# EAGLE design Raspberry_pi_shild_v1-- (EAGLE 6.5.0)
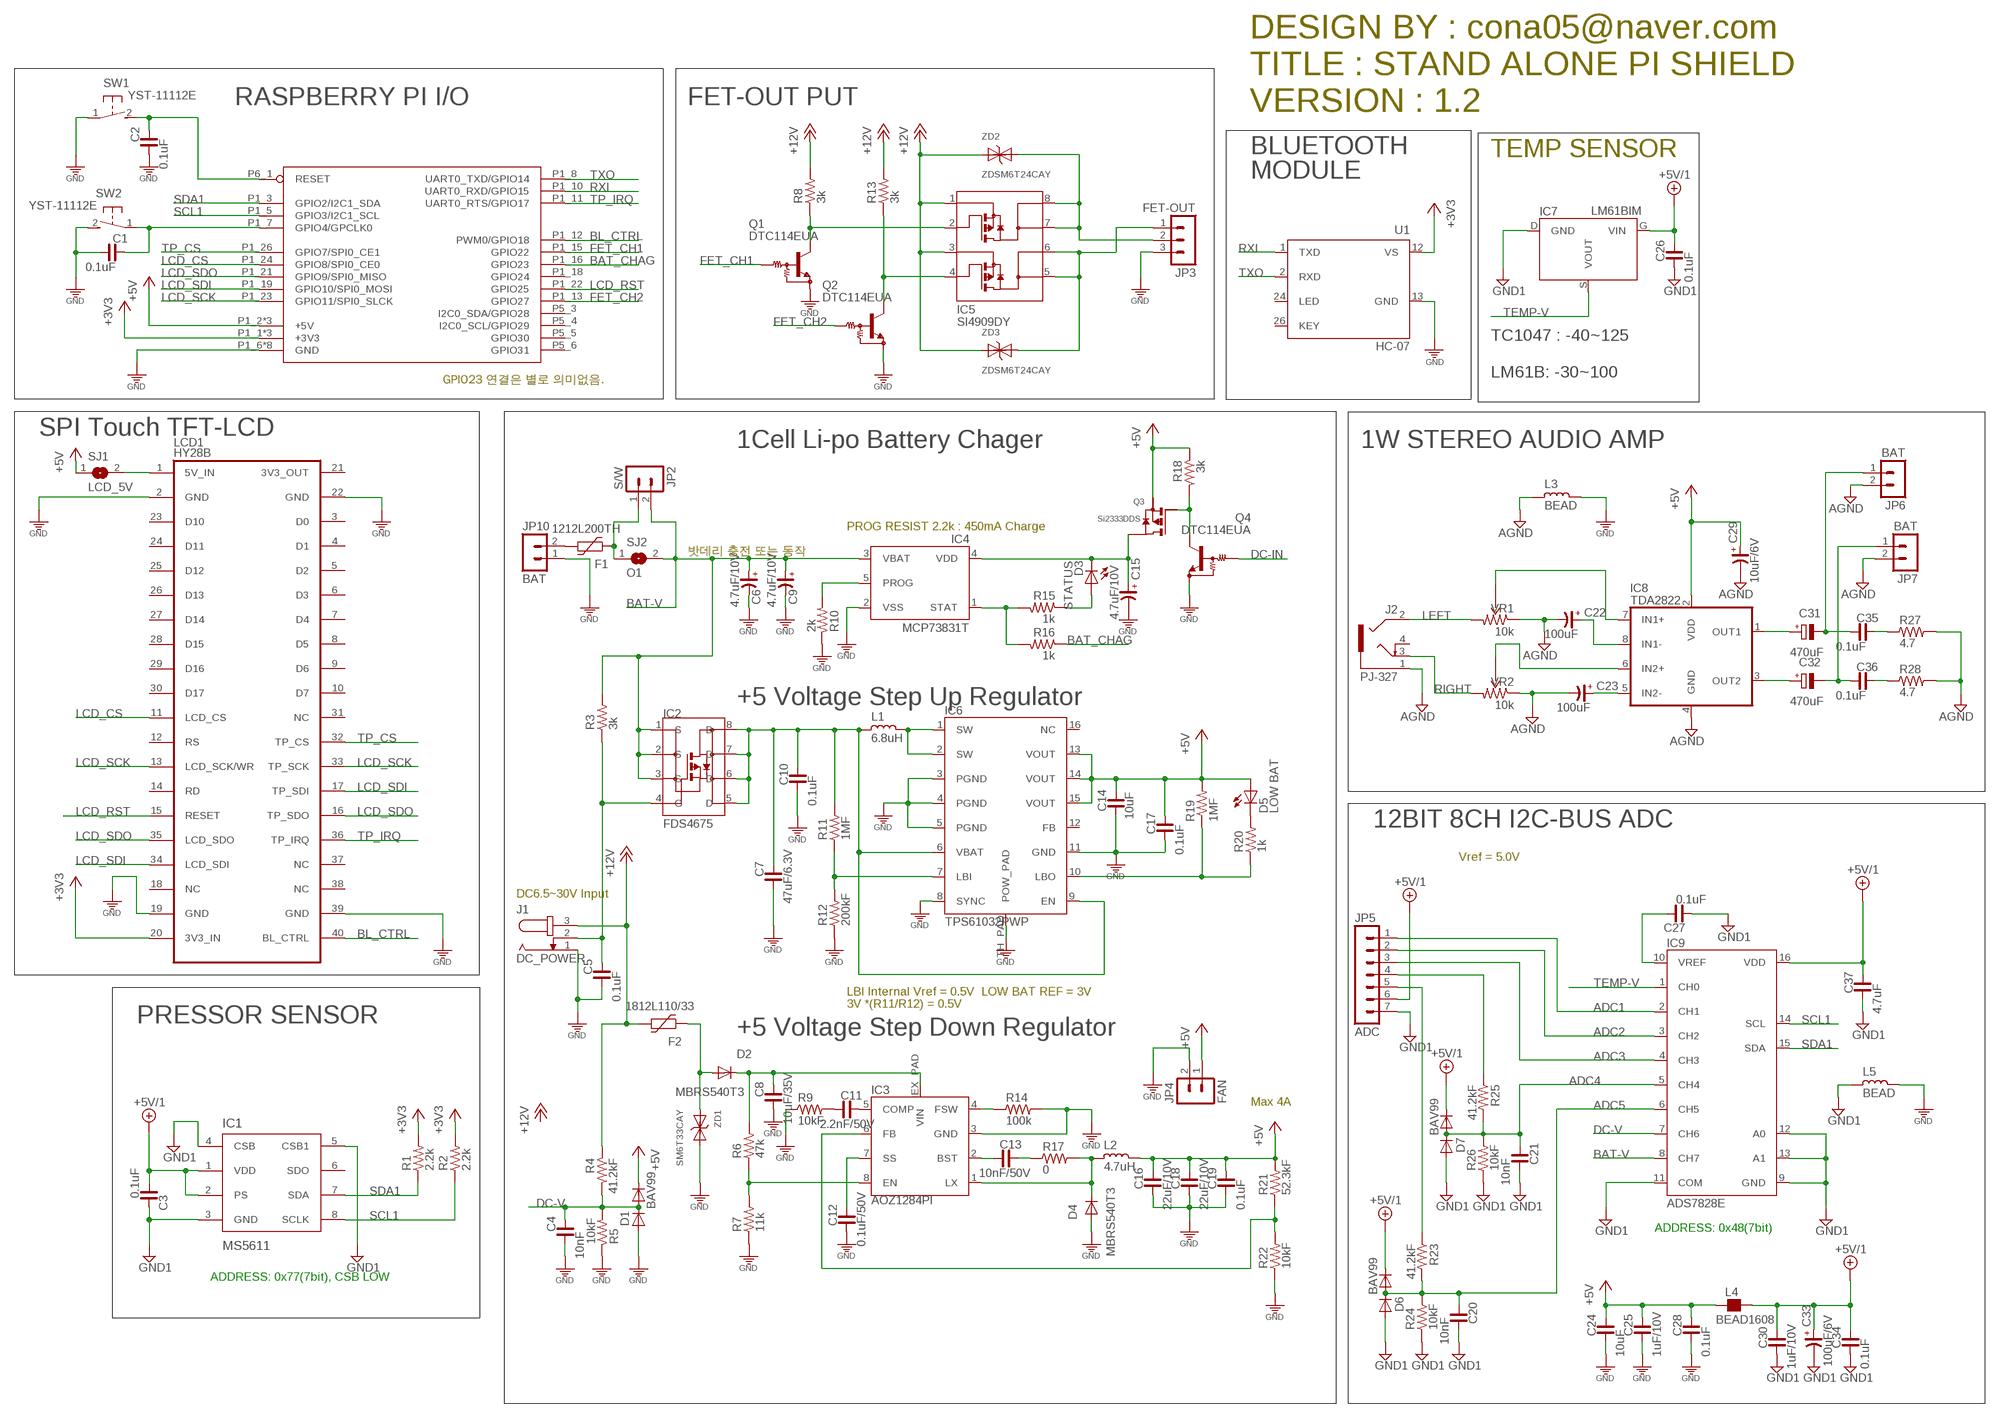
[diagram p0: schematic, sheet 1]

## Parts
C1  0.1uF  C_0603  [C0603]
C2  0.1uF  C_0603  [C0603]
C3  0.1uF  C_0603  [C0603]
C4  10nF  C_0603  [C0603]
C5  0.1uF  C_0603  [C0603]
C6  4.7uF/10V  CP_3216-18  [C3216-18/T]
C7  47uF/6.3V  C_3216  [C3216]
C8  10uF/35V  C_3225  [C3225]
C9  4.7uF/10V  CP_3216-18  [C3216-18/T]
C10  0.1uF  C_0603  [C0603]
C11  2.2nF/50V  C_0603  [C0603]
C12  0.1uF/50V  C_0603  [C0603]
C13  10nF/50V  C_0603  [C0603]
C14  10uF  C_2012  [C2012]
C15  4.7uF/10V  CP_3216-18  [C3216-18/T]
C16  22uF/10V  C_3216  [C3216]
C17  0.1uF  C_0603  [C0603]
C18  22uF/10V  C_3216  [C3216]
C19  0.1uF  C_0603  [C0603]
C20  10nF  C_0603  [C0603]
C21  10nF  C_0603  [C0603]
C22  100uF  CP_3528-21  [C3528-21/T]
C23  100uF  CP_3528-21  [C3528-21/T]
C24  10uF  C_0805  [C0805]
C25  1uF/10V  C_0603  [C0603]
C26  0.1uF  C_0603  [C0603]
C27  0.1uF  C_0603  [C0603]
C28  0.1uF  C_0603  [C0603]
C29  10uF/6V  CP_3216-18  [C3216-18/T]
C30  1uF/10V  C_0603  [C0603]
C31  470uF  CPOL-EUD/7343-31W  [D/7343-31W]
C32  470uF  CPOL-EUD/7343-31W  [D/7343-31W]
C33  100uF/6V  CP_3528-21  [C3528-21/T]
C34  0.1uF  C_0603  [C0603]
C35  0.1uF  C_0603  [C0603]
C36  0.1uF  C_0603  [C0603]
C37  4.7uF  C_0805  [C0805]
D1  BAV99  [SOT23]
D2  MBRS540T3  DIODE-SMC  [SMC]
D3  STATUS  LED3MM  [LED3MM]
D4  MBRS540T3  DIODE-SMC  [SMC]
D5  LOW BAT  LED3MM  [LED3MM]
D6  BAV99  [SOT23]
D7  BAV99  [SOT23]
F1  1212L200TH  1812L  [1812L]
F2  1812L110/33  1812L  [1812L]
IC1  MS5611  [LCP8]
IC2  FDS4675  HEXFET_P  [SO08]
IC3  AOZ1284PI  [S08-EP1]
IC4  MCP73831T  [SOT23-5L@1]
IC5  SI4909DY  P-CH_DUALSO-8  [SO08-1]
IC6  TPS61032PWP  TPS61032  [R-PDSO-G16-TH_PAD]
IC7  LM61BIM  [SOT23]
IC8  TDA2822  [SO08]
IC9  ADS7828E  ADS7828  [R-PDSO-G16]
J1  DC_POWER  JACK-PLUG0  [SPC4077]
J2  PJ-327  AUDIO_JACK2  [PJ-327-2]
JP2  S/W  MA02MOL-R  [MA02-MOL-R]
JP3  FET-OUT  MA03-1DEF  [MA03]
JP4  FAN  MA02MOL-R  [MA02-MOL-R]
JP5  ADC  MA07-1  [MA07-1T]
JP6  BAT  MA02MOL-R  [MA02-MOL-R]
JP7  BAT  MA02MOL-R  [MA02-MOL-R]
JP10  BAT  MA0253047  [53047-02]
L1  6.8uH  L_4545  [L4545]
L2  4.7uH  L_4545  [L4545]
L3  BEAD  L_0603  [L0603]
L4  BEAD1608  FB_0603  [L0603]
L5  BEAD  L_0603  [L0603]
LCD1  HY28B  [HY28A]
Q1  DTC114EUA  [SC59-BEC]
Q2  DTC114EUA  [SC59-BEC]
Q3  Si2333DDS  P-FET  [SOT23]
Q4  DTC114EUA  [SC59-BEC]
R1  2.2k  R_0603  [R0603]
R2  2.2k  R_0603  [R0603]
R3  3k  R_0603  [R0603]
R4  41.2kF  R_0603  [R0603]
R5  10kF  R_0603  [R0603]
R6  47k  R_0603  [R0603]
R7  11k  R_0603  [R0603]
R8  3k  R_0603  [R0603]
R9  10kF  R_0603  [R0603]
R10  2k  R_0603  [R0603]
R11  1MF  R_0603  [R0603]
R12  200kF  R_0603  [R0603]
R13  3k  R_0603  [R0603]
R14  100k  R_0603  [R0603]
R15  1k  R_0603  [R0603]
R16  1k  R_0603  [R0603]
R17  0  R_0603  [R0603]
R18  3k  R_0603  [R0603]
R19  1MF  R-US_R1608  [R0603]
R20  1k  R_0603  [R0603]
R21  52.3kF  R_0603  [R0603]
R22  10kF  R_0603  [R0603]
R23  41.2kF  R_0603  [R0603]
R24  10kF  R_0603  [R0603]
R25  41.2kF  R_0603  [R0603]
R26  10kF  R_0603  [R0603]
R27  4.7  R_0603  [R0603]
R28  4.7  R_0603  [R0603]
SJ1  LCD_5V  SJ  [SJ]
SJ2  O1  SJ  [SJ]
SW1  YST-11112E  [YST-1112E]
SW2  YST-11112E  [YST-1112E]
U1  HC-07  HC-06_MODULEFULL  [HC-06]
U$1  RPI-B-V2NO_SHIELD  [RPI-B-V2]
VR1  10k  R-TRIMMER-SMD3313  [R-TRIMMER-3313J]
VR2  10k  R-TRIMMER-SMD3313  [R-TRIMMER-3313J]
ZD1  SM6T33CAY  ZDSM6T33CAY  [SMB]
ZD2  ZDSM6T24CAY  ZDSM6T33CAY  [SMB]
ZD3  ZDSM6T24CAY  ZDSM6T33CAY  [SMB]

## Nets
+3V3: LCD1.20(3V3_IN) R1.2 R2.2 U1.12(VS) U$1.P1_1(+3V3) U$1.P1_17(+3V3) U$1.P5_2(+3V3)
+5V: C14.1 C16.1 C17.1 C18.1 C19.1 C24.1 C25.1 C28.1 C29.+ D1.S(C) D5.A IC6.13(VOUT) IC6.14(VOUT) IC6.15(VOUT) IC8.2(VDD) JP4.1 L2.1 L4.1 Q3.S(SOURCE) R18.1 R19.2 R21.2 SJ1.1 U$1.P1_2(+5V) U$1.P1_4(+5V) U$1.P5_1(+5V)
+5V/1: C3.2 C26.1 C30.1 C33.+ C34.1 C37.1 D6.S(C) D7.S(C) IC1.1(VDD) IC1.2(PS) IC7.G(VIN) IC9.16(VDD) JP5.6 L4.2
+12V: F2.P$2 IC5.1 IC5.3 J1.3 R4.1 R8.2 R13.2 ZD2.A ZD3.A
ADC1: IC9.2(CH1) JP5.1
ADC2: IC9.3(CH2) JP5.2
ADC3: IC9.4(CH3) JP5.3
ADC4: C21.1 D7.D(AC) IC9.5(CH4) R25.2 R26.2
ADC5: C20.1 D6.D(AC) IC9.6(CH5) R23.2 R24.2
AGND: C22.- C23.- C29.- IC8.4(GND) J2.1 JP6.2 JP7.2 L3.2 R27.2 R28.2 VR1.1 VR2.1
BAT-V: C6.+ C9.+ IC2.1(S) IC2.2(S) IC2.3(S) IC4.3(VBAT) IC9.8(CH7) JP2.2 R3.2 SJ2.2
BAT_CHAG: R16.1 U$1.P1_16(GPIO23)
BL_CTRL: LCD1.40(BL_CTRL) U$1.P1_12(PWM0/GPIO18)
DC-IN: D2.A F2.P$1 Q4.2(IN) ZD1.A
DC-V: C4.1 D1.D(AC) IC9.7(CH6) R4.2 R5.2
FET_CH1: Q1.2(IN) U$1.P1_15(GPIO22)
FET_CH2: Q2.2(IN) U$1.P1_13(GPIO27)
GND [GND]: C1.2 C2.2 C4.2 C5.2 C6.- C7.2 C8.2 C9.- C10.2 C12.2 C14.2 C15.- C16.2 C17.2 C18.2 C19.2 C24.2 C25.2 C28.2 D1.G(A) D4.A IC3.3(GND) IC4.2(VSS) IC6.3(PGND) IC6.4(PGND) IC6.5(PGND) IC6.8(SYNC) IC6.11(GND) IC6.TH_PAD(POW_PAD) J1.1 JP3.3 JP4.2 JP10.1 L3.1 L5.1 LCD1.2(GND) Q1.1(GND) Q2.1(GND) Q4.1(GND) R5.1 R7.1 R9.1 R10.1 R12.1 R14.2 R22.1 SW1.1 SW2.2 U1.13(GND) U$1.P1_6(GND) U$1.P1_9(GND) U$1.P1_14(GND) U$1.P1_20(GND) U$1.P1_25(GND) U$1.P5_7(GND) U$1.P5_8(GND) U$1.P6_2(GND) ZD1.C(K)
GND1: C3.1 C20.2 C21.2 C26.2 C27.2 C30.2 C33.- C34.2 C37.2 D6.G(A) D7.G(A) IC1.3(GND) IC1.4(CSB) IC1.5(CSB1) IC7.D(GND) IC9.9(GND) IC9.11(COM) IC9.12(A0) IC9.13(A1) JP5.7 L5.2 R24.1 R26.1
GND@1 [GND]: LCD1.19(GND) ; supply symbol labelled GND
GND@2 [GND]: LCD1.22(GND) ; supply symbol labelled GND
GND@3 [GND]: LCD1.39(GND) ; supply symbol labelled GND
LCD_CS: LCD1.11(LCD_CS) U$1.P1_24(GPIO8/SPI0_CE0)
LCD_RST: LCD1.15(RESET) U$1.P1_22(GPIO25)
LCD_SCK: LCD1.13(LCD_SCK/WR) LCD1.33(TP_SCK) U$1.P1_23(GPIO11/SPI0_SLCK)
LCD_SDI: LCD1.17(TP_SDI) LCD1.34(LCD_SDI) U$1.P1_19(GPIO10/SPI0_MOSI)
LCD_SDO: LCD1.16(TP_SDO) LCD1.35(LCD_SDO) U$1.P1_21(GPIO9/SPI0_MISO)
LEFT: J2.2 VR1.3
N$1: C1.1 SW2.1 U$1.P1_7(GPIO4/GPCLK0)
N$2: C8.1 D2.C IC3.EX_PAD(VIN) R6.2
N$3: IC3.6(FB) R21.1 R22.2
N$4: C13.2 IC3.2(BST)
N$5: F1.P$1 JP2.1 SJ2.1
N$6: C5.1 IC2.4(G) J1.2 R3.1
N$7: D3.A R15.1
N$8: C13.1 R17.1
N$9: D4.C IC3.1(LX) L2.2 R17.2
N$10: C11.1 IC3.5(COMP)
N$11: C11.2 R9.2
N$12: JP5.5 R23.1
N$13: C2.1 SW1.2 U$1.P6_1(RESET)
N$14: JP5.4 R25.1
N$15: D5.K(C) R20.2
N$16: F1.P$2 JP10.2
N$17: IC6.7(LBI) R11.1 R12.2
N$19: IC3.8(EN) R6.1 R7.2
N$20: IC5.2 Q1.3(OUT) R8.1
N$21: IC3.4(FSW) R14.1
N$22: C27.1 IC9.10(VREF)
N$23: Q3.G(GATE) Q4.3(OUT) R18.2
N$24: C12.1 IC3.7(SS)
N$26: C15.+ D3.K(C) IC4.4(VDD) Q3.D(DRAIN)
N$27: IC4.1(STAT) R15.2 R16.2
N$28: C7.1 C10.1 IC2.5(D) IC2.6(D) IC2.7(D) IC2.8(D) IC6.6(VBAT) IC6.9(EN) L1.2 R11.2
N$29: IC6.10(LBO) R19.1 R20.1
N$30: IC6.1(SW) IC6.2(SW) L1.1
N$31: IC5.4 Q2.3(OUT) R13.1
N$32: LCD1.1(5V_IN) SJ1.2
N$35: IC4.5(PROG) R10.2
N$36: C22.+ IC8.8(IN1-)
N$37: C23.+ IC8.5(IN2-)
N$39: IC8.6(IN2+) VR2.2
N$41: IC8.7(IN1+) VR1.2
N$42: C31.+ IC8.1(OUT1)
N$43: C32.+ IC8.3(OUT2)
N$44: C31.- C35.2 JP6.1
N$45: C32.- C36.2 JP7.1
N$46: C35.1 R27.1
N$47: C36.1 R28.1
RELAY1: IC5.5 IC5.6 JP3.1 ZD3.C(K)
RELAY2: IC5.7 IC5.8 JP3.2 ZD2.C(K)
RIGHT: J2.3 VR2.3
RXI: U1.1(TXD) U$1.P1_10(UART0_RXD/GPIO15)
SCL1: IC1.8(SCLK) IC9.14(SCL) R2.1 U$1.P1_5(GPIO3/I2C1_SCL)
SDA1: IC1.7(SDA) IC9.15(SDA) R1.1 U$1.P1_3(GPIO2/I2C1_SDA)
TEMP-V: IC7.S(VOUT) IC9.1(CH0)
TP_CS: LCD1.32(TP_CS) U$1.P1_26(GPIO7/SPI0_CE1)
TP_IRQ: LCD1.36(TP_IRQ) U$1.P1_11(UART0_RTS/GPIO17)
TXO: U1.2(RXD) U$1.P1_8(UART0_TXD/GPIO14)
Unconnected: IC1.6(SDO) IC6.12(FB) IC6.16(NC) J2.4 LCD1.3(D0) LCD1.4(D1) LCD1.5(D2) LCD1.6(D3) LCD1.7(D4) LCD1.8(D5) LCD1.9(D6) LCD1.10(D7) LCD1.12(RS) LCD1.14(RD) LCD1.18(NC) LCD1.21(3V3_OUT) LCD1.23(D10) LCD1.24(D11) LCD1.25(D12) LCD1.26(D13) LCD1.27(D14) LCD1.28(D15) LCD1.29(D16) LCD1.30(D17) LCD1.31(NC) LCD1.37(NC) LCD1.38(NC) U1.24(LED) U1.26(KEY) U$1.P1_18(GPIO24)

## Notes on the sheet
- DESIGN BY : cona05@naver.com
- TITLE : STAND ALONE PI SHIELD
- RASPBERRY PI I/O | FET-OUT PUT | VERSION : 1.2
- BLUETOOTH | TEMP SENSOR
- MODULE
- TC1047 : -40~125℃
- GPIO23 연결은 별로 의미없음. | LM61B: -30~100℃
- SPI Touch TFT-LCD
- 1Cell Li-po Battery Chager | 1W STEREO AUDIO AMP
- PROG RESIST 2.2k : 450mA Charge
- 밧데리 충전 또는 동작
- +5 Voltage Step Up Regulator
- 12BIT 8CH I2C-BUS ADC
- Vref = 5.0V
- DC6.5~30V Input
- LBI Internal Vref = 0.5V | LOW BAT REF = 3V
- 3V *(R11/R12) = 0.5V
- PRESSOR SENSOR
- +5 Voltage Step Down Regulator
- Max 4A
- ADDRESS: 0x48(7bit)
- ADDRESS: 0x77(7bit), CSB LOW

## Power pins joined to a net without a drawn wire
GPIO30: U$1.P5_5(GPIO30)
GPIO31: U$1.P5_6(GPIO31)
I2C0_SCL/GPIO29: U$1.P5_4(I2C0_SCL/GPIO29)
I2C0_SDA/GPIO28: U$1.P5_3(I2C0_SDA/GPIO28)

## Library data of the parts
C1-C5 C7 C8 C10-C14 C16-C21 C24-C28 C30 C34-C37 = cona_lib:C_: NON-POLARIZED CAP
C6 C9 C15 C22 C23 C29 C33 = rc-master-smd:CP_: POLARIZED CAP
C31 C32 = cona_lib:CPOL-EU: POLARIZED CAPACITOR, European symbol
D1 D6 D7 = cona_lib:BAV99
D2 D4 = diode:DIODE-: DIODE
D3 D5 = cona_lib:LED: LED OSRAM: - CHIPLED LG R971, LG N971, LY N971, LG Q971, LY Q971, LO R971, LY R971 LH N974, LH R974 LS Q976, LO Q976, LY Q976 LO Q996 - Hyper CHIPLED LW Q18S LB Q993, LB Q99A, LB R99A - SideLED LS A670, LO A670, LY A670, LG A670, LP A670 LB A673, LV A673, LT A673, LW A673 LH A674 LY A675 LS A676, LA A676, LO A676, LY A676, LW A676 LS A679, LY A679, LG A679 - Hyper Micro SIDELED® LS Y876, LA Y876, LO Y876, LY Y876 LT Y87S - SmartLED LW L88C, LW L88S LB L89C, LB L89S, LG L890 LS L89K, LO L89K, LY L89K LS L896, LA L896, LO L896, LY L896 - TOPLED LS T670, LO T670, LY T670, LG T670, LP T670 LSG T670, LSP T670, LSY T670, LOP T670, LYG T670 LG T671, LOG T671, LSG T671 LB T673, LV T673, LT T673, LW T673 LH T674 LS T676, LA T676, LO T676, LY T676, LB T676, LH T676, LSB T676, LW T676 LB T67C, LV T67C, LT T67C, LS T67K, LO T67K, LY T67K, LW E67C LS E67B, LA E67B, LO E67B, LY E67B, LB E67C, LV E67C, LT E67C LW T67C LS T679, LY T679, LG T679 LS T770, LO T770, LY T770, LG T770, LP T770 LB T773, LV T773, LT T773, LW T773 LH T774 LS E675, LA E675, LY E675, LS T675 LS T776, LA T776, LO T776, LY T776, LB T776 LHGB T686 LT T68C, LB T68C - Hyper Mini TOPLED® LB M676 - Mini TOPLED Santana® LG M470 LS M47K, LO M47K, LY M47K Source: http://www.osram.convergy.de LUXEON: - LUMILED® LXK2-PW12-R00, LXK2-PW12-S00, LXK2-PW14-U00, LXK2-PW14-V00 LXK2-PM12-R00, LXK2-PM12-S00, LXK2-PM14-U00 LXK2-PE12-Q00, LXK2-PE12-R00, LXK2-PE12-S00, LXK2-PE14-T00, LXK2-PE14-U00 LXK2-PB12-K00, LXK2-PB12-L00, LXK2-PB12-M00, LXK2-PB14-N00, LXK2-PB14-P00, LXK2-PB14-Q00 LXK2-PR12-L00, LXK2-PR12-M00, LXK2-PR14-Q00, LXK2-PR14-R00 LXK2-PD12-Q00, LXK2-PD12-R00, LXK2-PD12-S00 LXK2-PH12-R00, LXK2-PH12-S00 LXK2-PL12-P00, LXK2-PL12-Q00, LXK2-PL12-R00 Source: www.luxeon.com KINGBRIGHT: KA-3528ASYC Source: www.kingbright.com
F1 F2 = ptc-littlefuse:1812L
IC1 = MEASUREMENT_SENSOR:MS5611
IC2 = cona_lib:HEXFET_P
IC3 = cona_lib:AOZ1284PI
IC4 = cona_lib:MCP73831T
IC5 = cona_lib:P-CH_DUAL
IC6 = cona_lib:TPS61032
IC7 = cona_lib:LM61
IC8 = cona_lib:TDA2822
IC9 = cona_lib:ADS7828
J1 = con-jack:JACK-PLUG: DC POWER JACK Power Jack, DC, Right Angle, Through Hole, Rated 5A at 16VDC, PC Terminals Distributor: Farnell (www.Farnell.de) Drawing: 84N1161.pdf / 84N1162.pdf Manufacturer: SPC Technology (www.spctechnology.com) Type: SPC4077 / SPC 4078
J2 = cona_lib:AUDIO_JACK2
JP2 JP4 JP6 JP7 JP10 = cona_lib:MA02
JP3 = cona_lib:MA03-1: PIN HEADER
JP5 = cona_lib:MA07-1
L1-L3 L5 = cona_lib:L_: INDUCTOR
L4 = rc-master-smd:FB_: FERRITE BEAD
LCD1 = TFT-LCD:HY28B
Q1 Q2 Q4 = cona_lib:DTC114EUA: NPN Bias Resistor Transistor
Q3 = cona_lib:P-FET
R1-R18 R20-R28 = cona_lib:R_: RESISTOR
R19 = cona_lib:R-US_: RESISTOR, American symbol
SJ1 SJ2 = cona_lib:SJ: SMD solder JUMPER
SW1 SW2 = switch-tact:YST-11112E
U1 = cona_lib:HC-06_MODULE
U$1 = raspberrypi:RPI-B-V2: Second revision of the Model 2 board including the P5 and P6 headers. Mounting holes have been added. Choose the "SHIELD" variant for a predefined Dimension layer and drilling holes. Theres also a "SHIELD" variant for the Model A without a RJ45 connector.
VR1 VR2 = cona_lib:R-TRIMMER-SMD: SMD R-TRIMMER
ZD1-ZD3 = GRU-EURO6:ZD

## Net classes
0 default: width 0.178 mm, drill 0.3 mm, clearance 0.178 mm
1 power: width 0.152 mm
2 GND: width 0.152 mm, clearance 0.152 mm

## Board
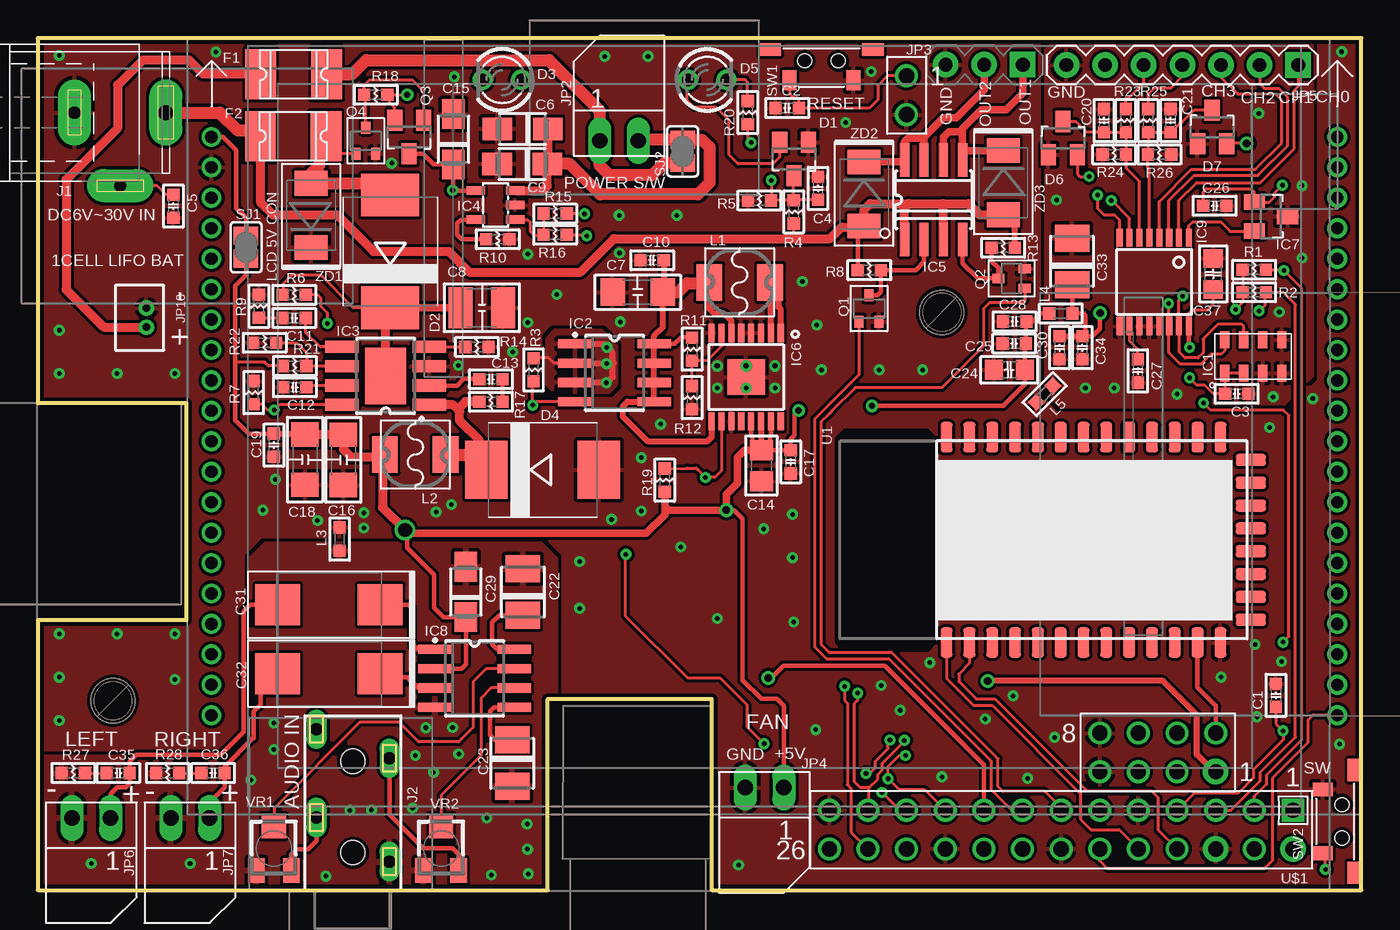
[diagram p1: board, top side]
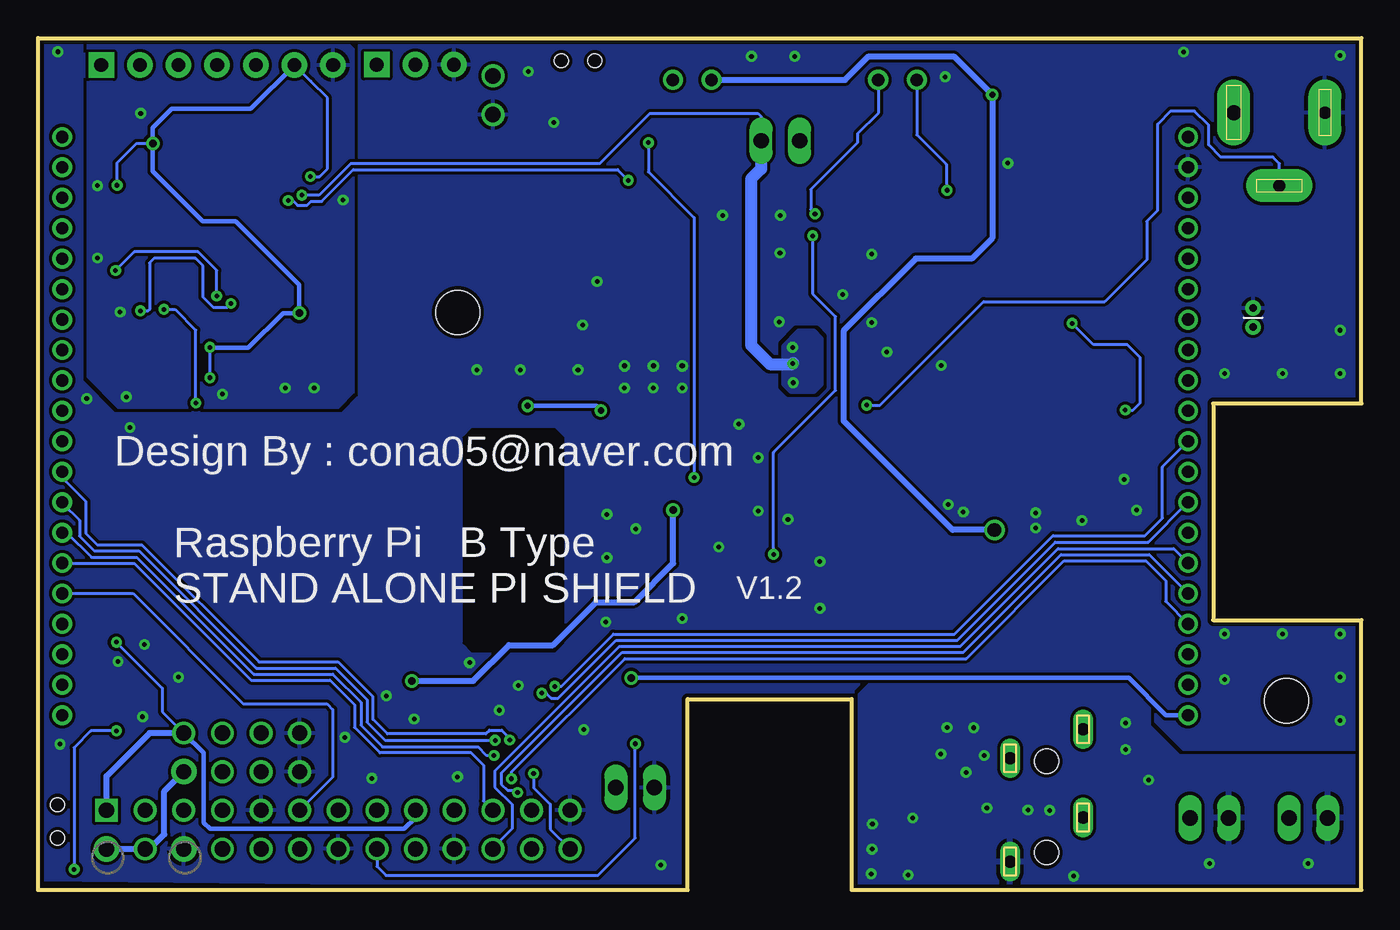
[diagram p2: board, bottom side, seen from below]

Size 87 x 56 mm. Coordinates in mm from the lower left corner, seen from the top.
Outline: 87,56 0,56 0,32 9.75,32 9.75,17.75 0,17.75 0,0 33.5,0 33.5,12.55 44.3,12.55 44.3,0 87,0 87,56
Copper layers (1*16): Top 0.035mm / dielectric 1.5mm / Bottom 0.035mm
Design rules "KHC_mm": minimum track width 0.2mm, minimum drill 0.3mm, track to track 0.2mm, track to pad 0.2mm, pad to pad 0.2mm, via to via 0.2mm, smd to smd 0.2mm, copper to edge 10mil, drill to drill 0.2mm, minimum pad ring 10mil, minimum via ring 8mil, stop-mask expansion 4mil, vias tented up to drill 0mil, thermal gap 10mil
Holes 2.9 mm at 59.4,37.98 4.92,12.45

### Footprints (pad centres in the part's own frame; a part is rotated, then mirrored left to right if it is on the bottom)
C0603 = smd 0.8 x 0.8: 1 -0.762,0; 2 0.762,0
C3216-18/T = smd 1.95 x 1.5: + 1.651,0; - -1.651,0
C3216 = smd 1.6 x 1.8: 1 -1.651,0; 2 1.651,0
C3225 = smd 1.6 x 2.7: 1 -1.397,0; 2 1.397,0
C2012 = smd 1.3 x 1.5: 1 -1.016,0; 2 1.016,0
C3528-21/T = smd 1.778 x 2.286: + 1.524,0; - -1.524,0
C0805 = smd 1.2 x 1.3: 1 -1.016,0; 2 1.016,0
D/7343-31W = smd 2.95 x 2.7: + 3.375,0; - -3.375,0
SOT23 = smd 1 x 1.4: D 0,-1.1; G 0.95,1.1; S -0.95,1.1
SMC = smd 2.8 x 3.8: A 3.7,0; C -3.7,0
LED3MM = drill 0.813: A -1.27,0; K 1.27,0
1812L = smd 2.03 x 3.3: P$1 -2.16,0; P$2 2.16,0
LCP8 = smd 1.1 x 0.6: 1 -1.1,1.875; 2 -1.1,0.625; 3 -1.1,-0.625; 4 -1.1,-1.875; 5 1.1,-1.875; 6 1.1,-0.625; 7 1.1,0.625; 8 1.1,1.875
SO08 = smd 0.6 x 2.2: 1 -1.905,-2.6; 2 -0.635,-2.6; 3 0.635,-2.6; 4 1.905,-2.6; 5 1.905,2.6; 6 0.635,2.6; 7 -0.635,2.6; 8 -1.905,2.6
S08-EP1 = smd 0.8 x 2.2: 1 -1.905,-2.87; 2 -0.635,-2.87; 3 0.635,-2.87; 4 1.905,-2.87; 5 1.905,2.87; 6 0.635,2.87; 7 -0.635,2.87; 8 -1.905,2.87 | smd 3.7 x 2.71: EX_PAD 0,0
SOT23-5L@1 = smd 0.55 x 1.2: 1 -0.95,-1.3; 2 0,-1.3; 3 0.95,-1.3; 4 0.95,1.3; 5 -0.95,1.3
SO08-1 = smd 0.6 x 2.2: 1 -1.905,-2.6; 2 -0.635,-2.6; 3 0.635,-2.6; 4 1.905,-2.6; 5 1.905,2.6; 6 0.635,2.6; 7 -0.635,2.6; 8 -1.905,2.6
R-PDSO-G16-TH_PAD = smd 0.4 x 1.2: 1 -2.275,-2.9; 2 -1.625,-2.9; 3 -0.975,-2.9; 4 -0.325,-2.9; 5 0.325,-2.9; 6 0.975,-2.9; 7 1.625,-2.9; 8 2.275,-2.9; 9 2.275,2.9; 10 1.625,2.9; 11 0.975,2.9; 12 0.325,2.9; 13 -0.325,2.9; 14 -0.975,2.9; 15 -1.625,2.9; 16 -2.275,2.9 | smd 2.46 x 2.31: TH_PAD 0,0
R-PDSO-G16 = smd 0.4 x 1.2: 1 -2.275,-2.9; 2 -1.625,-2.9; 3 -0.975,-2.9; 4 -0.325,-2.9; 5 0.325,-2.9; 6 0.975,-2.9; 7 1.625,-2.9; 8 2.275,-2.9; 9 2.275,2.9; 10 1.625,2.9; 11 0.975,2.9; 12 0.325,2.9; 13 -0.325,2.9; 14 -0.975,2.9; 15 -1.625,2.9; 16 -2.275,2.9
SPC4077 = drill 0.8 pad 2.184 long: 1 -3,0; 2 0,-4.8 | drill 1 pad 2.184 long: 3 3,0
PJ-327-2 = drill 0.8 long: 1 -2.4,-1.9; 2 2.4,-4.8; 3 -2.4,-8.7; 4 2.4,-10.6 | hole 1.6: 0,-2.5; 0,-8.5
MA02-MOL-R = drill 1.016 long: 1 -1.27,0; 2 1.27,0
MA03 = drill 0.9 pad 1.676 square: 1 -2.54,0 | drill 0.9 pad 1.676: 2 0,0; 3 2.54,0
MA07-1T = drill 0.9 pad 1.676 square: 1 -7.62,0 | drill 0.9 pad 1.676: 2 -5.08,0; 3 -2.54,0; 4 0,0; 5 2.54,0; 6 5.08,0; 7 7.62,0
53047-02 = drill 0.5 pad 0.95: 1 -0.625,0; 2 0.625,0
L4545 = smd 1.7 x 2.4: 1 -2,0; 2 2,0
L0603 = smd 0.8 x 0.8: 1 -0.762,0; 2 0.762,0
HY28A = drill 0.8: 1 -37,19; 2 -37,17; 3 -37,15; 4 -37,13; 5 -37,11; 6 -37,9; 7 -37,7; 8 -37,5; 9 -37,3; 10 -37,1; 11 -37,-1; 12 -37,-3; 13 -37,-5; 14 -37,-7; 15 -37,-9; 16 -37,-11; 17 -37,-13; 18 -37,-15; 19 -37,-17; 20 -37,-19; 21 37,19; 22 37,17; 23 37,15; 24 37,13; 25 37,11; 26 37,9; 27 37,7; 28 37,5; 29 37,3; 30 37,1; 31 37,-1; 32 37,-3; 33 37,-5; 34 37,-7; 35 37,-9; 36 37,-11; 37 37,-13; 38 37,-15; 39 37,-17; 40 37,-19
SC59-BEC = smd 0.6 x 0.8: 1 0.65,-0.863; 2 -0.65,-0.863; 3 0,0.863
R0603 = smd 0.8 x 0.8: 1 -0.762,0; 2 0.762,0
SJ = smd 1.168 x 1.6: 1 -0.762,0; 2 0.762,0
YST-1112E = smd 0.9 x 1.3: 1 -2.1,1.025; 2 2.1,1.025 | smd 1.45 x 0.8: SH -3.375,-1; SH@1 3.375,-1 | hole 0.9: 1.1,-0.25; -1.1,-0.25
HC-06 = smd 2 x 0.8: 1 -6.75,9; 2 -6.75,7.5; 3 -6.75,6; 4 -6.75,4.5; 5 -6.75,3; 6 -6.75,1.5; 7 -6.75,0; 8 -6.75,-1.5; 9 -6.75,-3; 10 -6.75,-4.5; 11 -6.75,-6; 12 -6.75,-7.5; 13 -6.75,-9; 22 6.75,-9; 23 6.75,-7.5; 24 6.75,-6; 25 6.75,-4.5; 26 6.75,-3; 27 6.75,-1.5; 28 6.75,0; 29 6.75,1.5; 30 6.75,3; 31 6.75,4.5; 32 6.75,6; 33 6.75,7.5; 34 6.75,9 | smd 0.8 x 2: 14 -5.25,-11; 15 -3.75,-11; 16 -2.25,-11; 17 -0.75,-11; 18 0.75,-11; 19 2.25,-11; 20 3.75,-11; 21 5.25,-11
RPI-B-V2 = drill 1 square: P1_1 0,0 | drill 1 pad 1.676: P1_2 0,2.54; P1_6 5.08,2.54; P5_1 5.08,-2.54 | drill 1: P1_3 2.54,0; P1_4 2.54,2.54; P1_5 5.08,0; P1_7 7.62,0; P1_8 7.62,2.54; P1_9 10.16,0; P1_10 10.16,2.54; P1_11 12.7,0; P1_12 12.7,2.54; P1_13 15.24,0; P1_14 15.24,2.54; P1_15 17.78,0; P1_16 17.78,2.54; P1_17 20.32,0; P1_18 20.32,2.54; P1_19 22.86,0; P1_20 22.86,2.54; P1_21 25.4,0; P1_22 25.4,2.54; P1_23 27.94,0; P1_24 27.94,2.54; P1_25 30.48,0; P1_26 30.48,2.54; P5_2 5.08,-5.08; P5_3 7.62,-2.54; P5_4 7.62,-5.08; P5_5 10.16,-2.54; P5_6 10.16,-5.08; P5_7 12.7,-2.54; P5_8 12.7,-5.08; P6_1 25.4,-48.26; P6_2 25.4,-45.72
R-TRIMMER-3313J = smd 1.1 x 1.6: 1 -1.15,-1.45; 3 1.15,-1.45 | smd 1.6 x 1.6: 2 0,1.45
SMB = smd 1.62 x 2.18: A 2.11,0; C -2.11,0

### Placement (x,y rotation side)
C1  81.38,12.8 90 top
C2  49.25,51.4 180 top
C3  78.8,32.62 180 top
C4  51.27,46.12 90 top
C5  8.9,44.95 270 top
C6  31.85,50.02 0 top
C7  39.42,39.3 180 top
C8  29.18,38.27 0 top
C9  31.82,47.73 0 top
C10  40.38,41.4 180 top
C11  16.85,37.6 180 top
C12  16.88,33.05 180 top
C13  29.77,33.58 180 top
C14  47.55,27.9 270 top
C15  27.3,49.35 270 top
C16  20.07,28.27 270 top
C17  49.48,28.15 270 top
C18  17.55,28.3 270 top
C19  15.5,29.25 270 top
C20  70.08,50.58 90 top
C21  74.45,50.58 90 top
C22  31.88,19.6 270 top
C23  31.18,8.35 90 top
C24  63.85,34.2 180 top
C25  64.17,35.92 180 top
C26  77.35,44.98 0 top
C27  72.3,34.12 270 top
C28  64.2,37.38 180 top
C29  28.12,19.6 270 top
C30  67.15,35.65 270 top
C31  19.12,18.75 0 top
C32  19.12,14.23 0 top
C33  67.97,41.33 270 top
C34  68.65,35.65 270 top
C35  5.27,7.7 0 top
C36  11.5,7.7 0 top
C37  77.25,40.5 90 top
D1  49.7,48.05 0 top
D2  23.15,41.98 90 top
D3  30.5,53.25 180 top
D4  33.17,27.62 0 top
D5  44,53.25 0 top
D6  67.38,49.42 180 top
D7  77.17,50.15 180 top
F1  16.8,53.62 180 top
F2  16.77,49.55 180 top
IC1  79.88,35.08 90 top
IC2  37.9,34 270 top
IC3  22.85,33.8 90 top
IC4  30.07,45.02 90 top
IC5  58.88,45.38 0 top
IC6  46.55,33.73 180 top
IC7  81.05,44.27 90 top
IC8  28.7,13.92 270 top
IC9  73.38,39.98 180 top
J1  5.4,51.1 0 top
J2  20.7,-0.02 180 top
JP2  38.2,49.25 0 top
JP3  62.2,54.25 180 top
JP4  47.75,6.75 180 top
JP5  75.22,54.23 180 top
JP6  3.5,4.75 180 top
JP7  10,4.75 180 top
JP10  7.12,37.62 270 top
L1  46.12,39.95 180 top
L2  24.8,28.62 0 top
L3  19.82,23.08 270 top
L4  67.22,37.9 0 top
L5  66.17,32.6 45 top
LCD1  48.4,30.5 0 top
Q1  54.62,38.23 0 top
Q2  64,40.2 90 top
Q3  24.4,49.5 0 top
Q4  21.55,49.25 0 top
R1  79.95,40.77 180 top
R2  79.95,39.3 180 top
R3  32.58,34.2 90 top
R4  49.67,44.58 90 top
R5  47.42,45.33 0 top
R6  16.85,39.12 180 top
R7  14.17,32.7 270 top
R8  54.65,40.75 180 top
R9  14.52,38.38 270 top
R10  30.23,42.77 180 top
R11  43,35.55 90 top
R12  43,32.38 90 top
R13  63.45,42.23 0 top
R14  28.85,35.7 0 top
R15  34,44.48 180 top
R16  34,43.08 180 top
R17  29.77,32.1 180 top
R18  22.2,52.27 180 top
R19  41.2,26.95 270 top
R20  46.65,51.1 90 top
R21  16.88,34.45 180 top
R22  14.9,35.98 0 top
R23  71.5,50.58 270 top
R24  70.75,48.35 0 top
R25  72.97,50.58 270 top
R26  73.72,48.35 180 top
R27  2.33,7.7 180 top
R28  8.52,7.7 180 top
SJ1  13.67,42.25 90 top
SJ2  42.38,48.55 90 top
SW1  51.5,54.25 180 top
SW2  85.47,4.52 90 top
U1  68.72,23.02 90 top
U$1  82.5,5.25 180 top
VR1  15.5,2.75 0 top
VR2  26.5,2.75 0 top
ZD1  17.95,44.35 90 top
ZD2  54.3,45.75 270 top
ZD3  63.45,46.5 270 top

### Tracks (layer width: path | path; a pad name or v marks a point on that pad's centre or on a via)
+3V3  (via drill 0.3, 0.5)
  Top 0.2: 79.21,39.33 R2.2 | R2.2 79.19,38.64 v78.72,38.17 | v81.85,16.3 82.22,16.67 82.22,31.2 81.88,31.55 77.1,31.55 v76.62,32.02 | R1.2 R2.2
  Top 0.3: U$1.P1_17 62.17,8.25 55.67,14.75 49,14.75 48.23,13.98 v48,13.95 | U1.12 76.22,13.33 77.42,12.12 U$1.P5_2
  Bottom 0.2: v78.72,38.17 78,38.17 76.62,36.8 v76.62,32.02 | v81.85,16.3 78.83,13.27 78.83,11.73 U$1.P5_2
  Bottom 0.3: v48,13.95 15.3,13.95 12.85,11.5 LCD1.20 | U$1.P1_17 62.18,4.77 62.92,4.02 75.7,4.02 76.12,4.45 76.12,9.03 U$1.P5_2
  Bottom 0.4: U$1.P1_1 82.5,7.5 79.67,10.33 U$1.P5_2
+5V  (via drill 0.4, 0.5, 0.9)
  Top 0.2: 15.49,30.02 C19.1 | v24.27,52.27 R18.1 23.12,52.11 23.12,51.75 23.45,51.42 Q3.S | 65.04,37.45 C28.1 | D1.S 48.75,48.17 48.3,47.73 46.02,47.73 45.42,48.33 45.42,50.6 44.58,51.45 43.12,51.45 42.67,51.9 42.67,53.2 D5.A | R21.2 15.15,34.45 14.9,34.7 12.98,34.7 12.95,34.67
  Top 0.3: IC8.2 27.84,14.56 28.12,14.85 C29.+ 28.1,17.92 26.68,17.92 26.02,18.58 26.02,20.73 24.25,22.5 24.25,23.55 v24.12,23.67 | IC6.15 48.17,29.9 48.1,29.82 48.1,29.47 C14.1 | IC6.13 46.88,29.85 46.98,29.75 46.98,29.49 C14.1 | C14.1 C17.1 49.48,29.65 49.73,29.9 49.73,31.27 49.98,31.52 v50,31.52 | JP4.1 49.02,12.13 48.58,12.58 47.55,12.58 46.33,13.8 46.33,24.4 45.75,24.98 v45.25,24.98 | 64.87,35.85 C25.1 | C25.1 64.87,35.85 C24.1 64.87,33.24 63.48,31.85 54.85,31.85 v54.83,31.82 | C25.1 64.94,37.35 C28.1 65.4,37.38 65.92,37.9 L4.1 | C19.1 15.49,30 13.85,30 12.95,30.9 12.95,34.67 12.95,39.73 13.67,40.45 SJ1.1
  Top 0.4: IC6.14 47.52,28.94 C14.1 | U$1.P5_1 77.31,7.79 76.17,8.92 76.17,11.52 73.95,13.75 v62.42,13.75
  Top 0.406: C18.1 15.56,29.95 C19.1
  Top 0.5: C14.1 46.45,28.93 45.98,28.45 45.98,26.75 45.25,26.02 v45.25,24.98 41.45,24.98 41.2,25.23 | 41.2,25.23 41.2,24.67 39.98,23.45 24.35,23.45 v24.12,23.67 | 41.2,25.23 R19.2
  Top 0.6: C18.1 17.57,29.93 C16.1 20.07,28.95 20.55,28.48 22.65,28.48 | 22.65,28.48 L2.1 | 22.65,28.48 22.65,25.15 v24.12,23.67
  Bottom 0.3: v54.83,31.82 50.3,31.82 v50,31.52
  Bottom 0.4: U$1.P1_2 U$1.P1_4 79.66,2.71 78.7,3.67 78.7,6.51 U$1.P5_1 | D5.A 33.95,53.25 32.4,54.8 26.8,54.8 v24.27,52.27 24.27,42.85 25.62,41.5 29.3,41.5 34.05,36.75 34.05,30.85 28.48,25.27 28.12,24.93 | v62.42,13.75 58.4,13.75 56.05,16.1 53.15,16.1 50.33,18.92 47.8,18.92 45.25,21.48 v45.25,24.98
  Bottom 0.406: v24.12,23.67 26.88,23.67 28.48,25.27
+5V/1  (via drill 0.3, 0.5)
  Top 0.2: v79.45,49.08 78.05,49.08 D7.S | 75.65,35.73 v75.7,35.67 | D6.S 68.33,47.08 68.5,46.9 v69.1,46.9 | C26.1 76.59,45.89 76.8,46.1 79.72,46.1 79.92,45.9 79.92,45.25 IC7.G 80.95,45.23 81.3,45.58 81.3,45.83 v81.8,46.33 | 77.43,39.3 C37.1 77.25,38.5 76.9,38.15 75.88,38.15 75.65,37.92 IC9.16 | IC1.2 IC1.1 78,32.66 C3.2 | 78.03,32.61 C3.2 | C3.2 77.28,32.62 76.7,33.2 76.17,33.2 v75.7,33.67
  Top 0.3: v69.83,37.92 69.8,37.9 69.8,36.9 69.31,36.41 C34.1 68.85,36.61 68.85,37.8 68.75,37.9 L4.2 C33.+ | 75.65,35.73 IC9.16
  Top 0.4: C30.1 C34.1
  Bottom 0.2: 79.38,49.05 v79.45,49.08 | 79.35,49.02 v79.45,49.08 | 69.03,46.98 v69.1,46.9 68.5,46.9 67.97,47.42 67.97,52.08 69.08,53.17 69.09,53.17 JP5.6 | 75.67,35.65 v75.7,35.67 v75.7,33.67 | 69.78,37.88 v69.83,37.92 | v81.8,46.33 81.8,47.8 80.53,49.08 v79.45,49.08
  Bottom 0.3: 75.67,35.65 73.17,35.65 70.9,37.92 v69.83,37.92 69.83,39.8 74,43.98 76.17,43.98 79.45,47.25 v79.45,49.08 79.45,50.1 78.2,51.35 73.02,51.35 JP5.6
+12V
  Top 0.2: R4.1 49.67,42.9 49.75,42.83
  Top 0.3: 53.89,43.23 R8.2
  Top 0.406: R13.2 64.21,43.63 ZD3.A | 53.89,43.23 ZD2.A
  Top 0.6: F2.P$2 14.62,45.21 15.45,44.38 19.65,44.38 22.05,41.98 27,41.98 28.35,40.62 35.65,40.62 37.85,42.83 49.75,42.83 52.08,42.83 52.83,43.58 54.37,43.58 | 54.83,43.64 54.76,43.58 54.37,43.58 | 57.25,45.12 54.7,45.12 54.3,44.73 ZD2.A 54.37,43.58 | 57.25,45.12 59.5,45.12 | 59.5,45.12 61.17,45.12 61.92,44.38 63.44,44.38 ZD3.A | IC5.3 59.51,45.12 59.5,45.12 | IC5.1 56.97,44.84 57.25,45.12
  Top 0.8: J1.3 11.95,51.1 13.12,49.92 14.52,49.92 F2.P$2
ADC1
  Top 0.2: IC9.2 75,45.33 76.17,46.5 80.35,46.5 82.58,48.73 82.58,52.55 82.84,52.82 JP5.1
ADC2
  Top 0.2: IC9.3 74.35,45.33 76,46.98 80.2,46.98 82.15,48.92 82.15,52.1 81.55,52.7 80.6,52.7 80.31,52.99 JP5.2
ADC3
  Top 0.2: IC9.4 73.7,45.25 75.83,47.38 80.03,47.38 81.75,49.1 81.75,51.92 81.38,52.3 78.9,52.3 77.77,53.44 JP5.3
ADC4
  Top 0.2: D7.D 77.05,51.27 76.03,51.27 75.24,50.49 C21.1 R25.2 R26.2 72.95,48.34 72.95,47.5 73.05,47.4 IC9.5
ADC5
  Top 0.2: D6.D 67.4,50.5 68.25,50.5 68.94,49.81 C20.1 R23.2 71.5,48.36 R24.2 71.51,47.46 72.4,46.58 IC9.6
AGND  (via drill 0.3)
  other vias: 32.17,2.7 29.5,4.75 26,7.75 10,1.75 3.5,1.75 20.5,5.25 14,7.25 15.5,9.25 25.5,10.67 27.25,10.7 15.5,11 32.23,1.08 32.15,4.35 29.8,1 18.93,0.92 21.93,5.27 24.62,5.4 27.65,8.95 24.8,8.85
  pour Top: 0,-0.25 0,8.75 12,8.75 14,10.75 14,21.75 15,22.75 33,22.75 34,21.75 34,-0.3
  pour Bottom: 0,-0.25 0,8.75 12,8.75 14,10.75 14,12.25 15.5,13.75 32,13.75 33.5,12.25 33.5,-0.3
BAT-V  (via drill 0.3)
  Top 0.2: IC2.2 33.91,34.64 33.58,34.98 32.59,34.98 R3.2 | IC9.8 71.1,44.02 70.75,44.38 70.08,44.38 69.65,44.8 v69.65,45.67
  Top 0.4: IC2.2 37.84,34.64 | 37.84,34.64 37.85,34.65 37.73,34.77 37.73,35.4 37.22,35.91 IC2.1 | IC2.3 37.41,33.36 37.77,33.73 37.77,34.58 37.84,34.64
  Top 0.6: C6.+ 33.5,47.75 C9.+ 33.48,46.27 33.17,45.98 IC4.3
  Top 0.8: C9.+ 34.95,47.73 36.95,45.73 43.38,45.73 44.15,46.5 44.15,48.83 43.66,49.31 SJ2.2 39.53,49.31 JP2.2
  Bottom 0.2: JP2.2 39.48,50.85 39.67,51.05 46.77,51.05 50.08,47.75 66.45,47.75 68.53,45.67 v69.65,45.67
  Bottom 0.8: JP2.2 39.47,47.41 40.12,46.75 40.12,35.8 38.9,34.58 37.41,34.58 37.35,34.64
  other vias: 37.4,35.67 37.38,34.6 37.35,33.35
  pour Top: 34,36.75 37,36.75 38,35.75 38,33.25 37.5,32.75 34,32.75 33.5,33.25 33.5,36.25
  pour Bottom: 36,36.75 37,36.75 38,35.75 38,33.25 37.5,32.75 36,32.75 35.5,33.25 35.5,36.25
BAT_CHAG  (via drill 0.3)
  Top 0.2: v38.65,22.08 38.6,22.02 38.6,18.05 42.7,13.95 44.83,13.95 46.6,12.17 46.6,10.75 v47.73,9.62 | R16.1 36,43.08 v36.08,43
  Bottom 0.2: U$1.P1_16 64.72,1.57 64.12,0.98 50.2,0.98 47.75,3.42 47.75,9.6 v47.73,9.62 | v38.65,22.08 38.65,28.77 34.58,32.85 34.58,37.7 36.08,39.2 v36.08,43
BL_CTRL
  Top 0.2: U$1.P1_12 69.8,1.92 70.28,1.45 80.65,1.45 81.17,1.98 81.17,7.4 83.47,9.7 83.47,11.17 83.8,11.5 LCD1.40
DC-IN
  Top 0.2: Q4.2 18.86,48.39 18.5,48.75
  Top 0.8: F2.P$1 18.5,49.12 18.5,48.75 18.5,47.65 17.95,47.1 ZD1.A 22.36,46.46 D2.A
DC-V  (via drill 0.3)
  Top 0.2: IC9.7 71.75,44.15 70.58,45.33 v70.55,45.33 | R4.2 49.67,46.92 D1.D | C4.1 49.7,45.36 R4.2 | R4.2 48.2,45.34 R5.2 48.2,45.34 v48.2,46.65
  Bottom 0.2: v70.55,45.33 70.28,45.33 69.95,45 69.33,45 69.05,45.27 68.35,45.27 66.28,47.35 48.9,47.35 v48.2,46.65
FET_CH1
  Top 0.2: U$1.P1_15 64.03,5.25 62.67,6.6 62.67,8.48 55.92,15.23 51.83,15.23 51.05,16 51.05,30.95 53.98,33.88 Q1.2
FET_CH2
  Top 0.2: U$1.P1_13 67.26,5.41 66.17,6.5 63.42,6.5 63.1,6.83 63.1,8.65 56.1,15.65 52,15.65 51.48,16.17 51.48,30.77 52.02,31.32 52.2,31.5 53.73,33.02 59.42,33.02 62.15,35.75 62.15,38.23 62.52,38.6 64.72,38.6 64.86,38.74 Q2.2
GND  (via drill 0.3, 0.33)
  other vias: 46.55,34.45 46.55,33 48.45,34.45 48.45,33 44.65,34.45 44.65,33 1.4,36.8 1.4,33.95 5.2,33.95 9,33.95 9,16.85 5.2,16.85 1.4,16.85 1.4,14 1.4,11.15 46.05,1.65 35.6,18.52 44.65,17.85 14.77,24.98 65.05,7.35 58.62,14.95 62.27,11.25 59.42,7.45 66.83,10.05 77.78,14 80,16.15 81.75,15.02 80.95,30.4 83.8,32.3 55.3,34.2 51.5,34.2 47.7,23.75 49.6,24.7 49.6,21.85 42.25,22.55 35.6,21.6 26.18,24.85 32.2,37.3 34.1,39.15 38.2,44.35 42,44.35 37.25,54.8 40.1,54.8 1.4,54.85 85.7,55.1 54.77,53.8 53.1,50.45 50.25,40 51.2,37.15 58.15,34.2 38.23,41.88 38.27,37.35 23.25,47.77 27.38,53.45 32.2,41.8 15.6,27 39.65,28.43 40.92,30.62 11.7,55.08 85.55,9.6 51.12,10.55 27.62,34.48 31.2,35.38 18.38,24.3 21.43,24.8 21.43,23.8 39.65,24.93 37.7,24.38 27.18,25.35 9,13.85 56.67,11.83 55.42,13.45 49.67,17.62 64.1,12.77 80.12,11.4
  pour Top (isolate 0.152, rank 2): 87.1,-0.25 0,-0.25 0,56 87.1,56
  pour Bottom (isolate 0.152, rank 2): 87.1,0.7 0,-0.25 0,56 87.1,56
GND1  (via drill 0.3)
  other vias: 83.1,46.3 80.25,51.05 66.95,45.35 83.1,41.55 68.85,33 70.75,33 74.88,32.6 81.2,32.42 81.6,38
  pour Bottom: 67,56 83.75,56 83.75,33.75 81.75,31.75 67.25,31.75 66.25,32.75 66.25,55.25
  pour Top: 67,56 83.75,56 83.75,33.75 81.75,31.75 67.25,31.75 66.25,32.75 66.25,55.25
LCD_CS  (via drill 0.3)
  Top 0.2: U$1.P1_24 53.45,3.82 53.45,6.7 53.2,6.95 53.2,12.3 53.02,12.48 v53.02,13.4
  Bottom 0.2: LCD1.11 13.08,27.82 13.08,24.45 14.23,23.3 20.27,23.3 26.75,16.83 49.17,16.83 52.6,13.4 v53.02,13.4
LCD_RST
  Bottom 0.2: U$1.P1_22 57.1,2.77 55.85,4.02 55.85,5.65 56.98,6.77 56.98,7.83 48.77,16.02 26.38,16.02 19.95,22.45 12.35,22.45 LCD1.15
LCD_SCK  (via drill 0.3)
  Top 0.2: v53.88,12.95 53.88,12.48 53.65,12.25 53.65,7.15 54.02,6.77 54.58,6.77 54.62,6.73 | U$1.P1_23 54.62,5.31 54.62,6.73 | v56.95,9.85 56.95,9.77 55.48,8.3 55.48,7.88 55.2,7.6 55.2,7.3 54.62,6.73
  Bottom 0.2: v56.95,9.85 64.17,9.85 65.38,11.05 65.38,12.52 67.45,14.6 72.65,14.6 80.35,22.3 83.3,22.3 84.28,23.27 84.28,24.3 85.4,25.43 LCD1.33 | LCD1.13 14.02,22.88 20.12,22.88 26.57,16.42 49,16.42 52.8,12.62 53.27,12.62 53.6,12.95 v53.88,12.95
LCD_SDI  (via drill 0.3)
  Top 0.2: U$1.P1_19 58.27,6.62 56.6,6.62 56.42,6.8 v55.88,7.33 55.88,8.12 56.6,8.85 v57.02,8.85
  Bottom 0.2: LCD1.34 85.1,23.5 83.47,21.88 80.5,21.88 72.83,14.2 67.62,14.2 65.78,12.35 65.78,10.85 64.35,9.42 58.08,9.42 57.5,8.85 v57.02,8.85 | v55.88,7.33 55.88,7.77 48.42,15.23 25.98,15.23 19.55,21.65 14.17,21.65 12.88,20.35 12.88,18.98 LCD1.17
LCD_SDO  (via drill 0.3)
  Top 0.2: U$1.P1_21 56.65,5.25 v55.48,6.42
  Bottom 0.2: U$1.P1_21 57.73,5.88 57.73,8.23 58.52,9.02 64.53,9.02 66.2,10.7 66.2,12.2 67.8,13.8 73,13.8 80.67,21.48 85.38,21.48 LCD1.35 | v55.48,6.42 55.3,6.58 56.15,6.58 56.55,6.98 56.55,7.67 48.6,15.62 26.18,15.62 19.75,22.05 13.95,22.05 LCD1.16
LEFT
  Top 0.3: J2.2 18.3,3.25 17.75,2.7 17,2.7 16.65,2.35 VR1.3
N$1  (via drill 0.3)
  Top 0.2: v84.62,1.38 84.62,2.25 SW2.1 | C1.1 81.38,10.95 v81.85,10.48 81.85,9.88 79.9,7.92 79.9,7.38 78.9,6.38 76,6.38 U$1.P1_7
  Bottom 0.2: v81.85,10.48 83.53,10.48 84.62,9.38 v84.62,1.38
N$2
  Top 0.2: R6.2 16.1,39.85 16.65,40.4 18.6,40.4 20.73,38.27 D2.C 22.85,37.98
  Top 0.5: D2.C 23.62,38.75 24.1,38.27 C8.1
  Top 0.6: IC3.EX_PAD 22.85,37.98
N$3
  Top 0.2: IC3.6 17.65,34.44 R21.1 17.65,34.46 17.65,35.33 17,35.98 R22.2
N$4
  Top 0.3: IC3.2 27.54,33.16 27.98,33.6 28.99,33.6 C13.2
N$5
  Top 0.8: F1.P$1 20.65,53.62 21.57,54.55 33.6,54.55 36.93,51.22 JP2.1 36.92,47.62 37.58,46.98 40.35,46.98 41.16,47.79 SJ2.1
N$6  (via drill 0.3)
  Top 0.2: C5.1 8.41,45.71 7.83,46.3 J1.2 | R3.1 32.52,33.39 v32.52,31.88 32.74,32.09 IC2.4
  Bottom 0.2: J1.2 5.4,47.75 5.83,48.17 9.25,48.17 10.05,48.98 10.05,50.27 10.98,51.2 12.55,51.2 13.4,50.35 13.4,44.67 14.12,43.95 14.12,41.42 16.88,38.67 24.85,38.67 31.65,31.88 v32.52,31.88
N$7  (via drill 0.3)
  Top 0.2: v35.92,44.45 34.79,44.45 R15.1
  Bottom 0.2: D3.A 31.73,52.7 31.73,51.1 33.12,49.7 33.12,49.12 36.2,46.05 36.2,44.73 v35.92,44.45
N$8
  Top 0.3: C13.1 R17.1
N$9
  Top 0.3: 29.01,28.31 28.9,28.2
  Top 0.6: 29.01,28.31 29.01,29.56 27.73,30.85 27.73,31.48 27.6,31.6 | 27.6,31.6 27.3,31.9 IC3.1 | R17.2 28.1,32.1 27.6,31.6
  Top 0.8: D4.C 28.9,28.2 28.48,28.62 L2.2 26.82,28.65
N$10
  Top 0.2: IC3.5 18.55,35.7 17.6,36.65 17.6,37.59 C11.1
N$11
  Top 0.2: C11.2 14.54,37.6 R9.2
N$12
  Top 0.2: R23.1 71.5,52.05 71.67,52.05 72.7,53.08 JP5.5
N$13
  Top 0.2: U$1.P6_1 55.84,53.51 55.2,52.88 55.2,51.95 54.65,51.4 C2.1 50,51.41 50,52 49.88,52.12 49.62,52.12 49.4,52.35 SW1.2
N$14
  Top 0.2: R25.1 72.97,52.3 73.42,52.75 74.5,52.75 75.23,53.48 75.22,53.48 JP5.4
N$15
  Top 0.2: R20.2 46.65,53.08 46.48,53.25 D5.K
N$16
  Top 0.6: F1.P$2 10.85,53.62 9.92,54.55 6.88,54.55 5.23,52.9 5.23,50.08 1.85,46.7 1.85,39.48 4.33,37 JP10.2
N$17
  Top 0.2: IC6.7 44.92,35.75 43.98,34.8 43.01,34.8 R11.1 R12.2
N$18
  cutout Bottom: 53,30.25 58.5,30.25 59,29.75 59,16.25 58.5,15.75 53,15.75 52.5,16.25 52.5,29.75
  cutout Top: 53,30.25 58.5,30.25 59,29.75 59,16.25 58.5,15.75 53,15.75 52.5,16.25 52.5,29.75
N$19  (via drill 0.3)
  Top 0.2: IC3.8 15.87,31.89 v15.52,31.55 15.1,31.55 14.73,31.93 14.19,31.93 R7.2 | v19.02,37.25 19.02,37.92 18.6,38.35 18.6,38.9 18.38,39.12 R6.1
  Bottom 0.2: v15.52,31.55 15.02,31.55 14.55,32.02 14.55,35 15.4,35.85 17.62,35.85 v19.02,37.25
N$20
  Top 0.3: IC5.2 58.24,41.29 57.7,40.75 R8.1 55.41,39.34 55.17,39.1 54.64,39.1 Q1.3
N$21
  Top 0.2: IC3.4 R14.1
N$22
  Top 0.2: IC9.10 71.75,36.1 72.3,35.55 C27.1
N$23
  Top 0.2: 21.55,52.24 R18.2 | Q3.G 25.35,52.5 24.6,53.25 21.8,53.25 21.44,52.89 R18.2 | Q4.3 21.55,52.16 R18.2
N$24
  Top 0.2: IC3.7 17.75,33.16 C12.1
N$26  (via drill 0.3)
  Top 0.2: v27.25,46 27.25,45.8 27.52,46.08
  Top 0.3: Q3.D 25.3,48.4 26,47.7 C15.+ 27.3,46.3 27.52,46.08 27.62,45.98 IC4.4
  Bottom 0.2: D3.K 29.23,49.63 C15.+ 27.3,46.05 v27.25,46
N$27
  Top 0.2: R15.2 R16.2 33.21,43.05 32.6,43.05 32.35,43.3 32.35,43.9 32.17,44.08 IC4.1
N$28
  Top 0.3: IC2.8 41.86,35.91 42.3,36.35 42.96,36.35 R11.2
  Top 0.4: C10.1 41.14,39.36 C7.1 41.08,37 40.5,36.42 IC2.8 IC2.7 IC2.6 IC2.5 38.75,32.1 38.45,31.8 38.45,31.12 40.1,29.48 43.98,29.48 44.27,29.77 IC6.9 | IC6.6 45.58,37.42 45.12,37.88 44.45,37.88 44.12,38.2 L1.2
  Top 0.8: C7.1 42.08,39.3 42.67,39.9 44.08,39.9 L1.2
N$29  (via drill 0.3)
  Top 0.2: R20.1 46.65,49.35 v46.88,49.12 | IC6.10 44.92,27.55 44.5,27.12 v43.88,27.12 43.38,27.62 43.29,27.71 43.26,27.74 42.65,27.74 R19.1
  Bottom 0.2: v46.88,49.12 46.88,47.2 43.88,44.2 v43.88,27.12
N$30
  Top 0.4: IC6.2 48.17,39.9 L1.1 48.7,39.38 48.7,38.3 48.83,38.17 IC6.1
N$31
  Top 0.3: IC5.4 60.78,41.2 61.77,40.2 Q2.3 63.12,40.21 63.12,40.9 62.69,41.34 R13.1
N$32
  Top 0.3: SJ1.2 13.67,44.17 13.02,44.83 13.02,48.62 12.15,49.5 LCD1.1
N$35
  Top 0.3: IC4.5 27.8,44.08 27.55,43.83 27.55,43.08 27.85,42.77 R10.2
N$36
  Top 0.3: C22.+ 30.33,18.08 29.85,17.6 29.85,16.15 30.18,15.83 31.47,15.83 IC8.8
N$37
  Top 0.3: IC8.5 29.97,12.02 29.73,11.77 29.73,10.17 30.02,9.88 31.47,9.88 C23.+
N$39
  Top 0.2: IC8.6 29.79,13.29 29.12,12.62 29.12,8.88 26.5,6.25 VR2.2
N$41
  Top 0.2: IC8.7 29.46,14.56 28.6,13.7 28.6,10.7 27.65,9.75 25.02,9.75 23.75,11.02 21.15,11.02 15.52,5.4 15.52,4.23 VR1.2
N$42
  Top 0.3: IC8.1 24.95,15.83 24.57,16.2 24.57,18.55 24.38,18.75 C31.+
N$43
  Top 0.3: IC8.3 24.98,13.29 24.27,14 22.73,14 C32.+
N$44
  Top 0.3: JP6.1 4.77,6.34 5.2,6.77 5.77,6.77 6.04,7.04 C35.2 6.02,7.71 6.02,8.48 6.45,8.9 12,8.9 13.52,10.42 13.52,18.33 13.95,18.75 C31.-
N$45
  Top 0.3: JP7.1 11.27,5.77 12.27,6.77 12.27,7.69 | 12.27,7.69 C36.2 | 12.27,7.69 12.27,8.12 14.12,9.98 14.15,9.98 14.17,10 14.17,11.75 14.62,12.2 14.62,13.1 C32.-
N$46
  Top 0.2: R27.1 C35.1
N$47
  Top 0.2: R28.1 C36.1
RELAY1
  Top 0.5: IC5.5 60.78,48.77 | 60.78,48.77 60.78,50.03 | 60.78,50.03 62.02,51.27 63.65,51.27 64.74,52.37 JP3.1 | IC5.6 59.51,49.48 59.88,49.85 60.6,49.85 60.78,50.03 | ZD3.C 60.95,48.61 60.78,48.77
RELAY2
  Top 0.5: IC5.7 58.24,49.49 | 58.24,49.49 59.52,50.77 60.38,50.77 62.2,52.6 JP3.2 | 58.24,49.49 58.15,49.4 57.2,49.4 56.97,49.17 IC5.8 56.86,47.86 ZD2.C
RIGHT
  Top 0.3: J2.3 23.1,4.95 25.3,2.75 27.25,2.75 27.65,2.35 VR2.3
RXI
  Top 0.2: U1.1 59.73,13.92 61.5,12.15 62.73,12.15 68.53,6.35 68.53,4.67 69.22,3.98 71.08,3.98 U$1.P1_10
SCL1  (via drill 0.3)
  Top 0.2: v80.28,38.08 80.33,38.08 80.67,38.42 80.67,39.14 R2.1 81.85,39.3 82.65,38.5 82.65,10.05 80.33,7.73 80.33,7.17 78.4,5.25 U$1.P1_5 | IC1.8 78,35.45 77.78,35.23 77.1,35.23 76.45,34.58 75.1,34.58 74.35,35.33 IC9.14 74.35,38.52 v74.33,38.55
  Bottom 0.2: v80.28,38.08 79.78,38.08 79.67,38.17 79.67,41.23 79.38,41.52 76.65,41.52 76.15,41.02 76.15,38.98 75.5,38.33 74.55,38.33 v74.33,38.55
SDA1  (via drill 0.3)
  Top 0.2: IC1.7 79.25,37.05 79.08,37.23 77.6,37.23 76.6,36.23 76.6,35.33 76.25,34.98 75.4,34.98 75,35.38 IC9.15 75,38.8 v75.25,39.05 | R1.1 81.85,40.77 v81.9,40.73 83.08,39.55 83.08,9.88 80.75,7.55 80.75,6.95 79.96,6.16 U$1.P1_3
  Bottom 0.2: v75.25,39.05 75.25,40.73 76.47,41.95 80.67,41.95 v81.9,40.73
TEMP-V
  Top 0.2: IC9.1 75.65,43.67 75.9,43.92 77.75,43.92 78.38,43.3 79.92,43.3 IC7.S
TP_CS  (via drill 0.3)
  Top 0.2: v54.42,7.67 54.67,7.67 55.05,8.05 55.05,8.48 55.88,9.3 55.88,9.75 v56,9.88
  Bottom 0.2: U$1.P1_26 53.33,4.02 53.33,5.65 54.42,6.75 v54.42,7.67 | LCD1.32 85.4,27.1 83.85,25.55 83.85,23.45 83.1,22.7 80.17,22.7 72.47,15 67.28,15 64.97,12.7 64.97,11.23 64.03,10.27 57.58,10.27 57.33,10.52 56.52,10.52 56,10 v56,9.88
TP_IRQ
  Bottom 0.2: U$1.P1_11 67.62,7.42 67.62,11.88 68,12.25 73.5,12.25 80.75,19.5 LCD1.36
TXO
  Top 0.2: U1.2 61.23,14.9 60.52,14.2 60.52,13.73 61.67,12.58 62.9,12.58 68.95,6.52 73.2,6.52 73.62,6.1 73.62,3.97 U$1.P1_8

### Text on the board
_tplace: OUT1 | GND | OUT2 | GND | CH3 | CH2 | CH1 | CH0 | RESET | POWER S/W | DC6V~30V IN | 1CELL LIFO BAT | - | LCD 5V CON | + | FAN | LEFT | RIGHT | GND | +5V | SW | - | + | - | + | AUDIO IN
_bplace: Design By : cona05@naver.com | Raspberry Pi B Type | V1.2 | STAND ALONE PI SHIELD